# EAGLE design Relay Shield v3.0 (EAGLE 6.4)

## Sheet 1 of 2
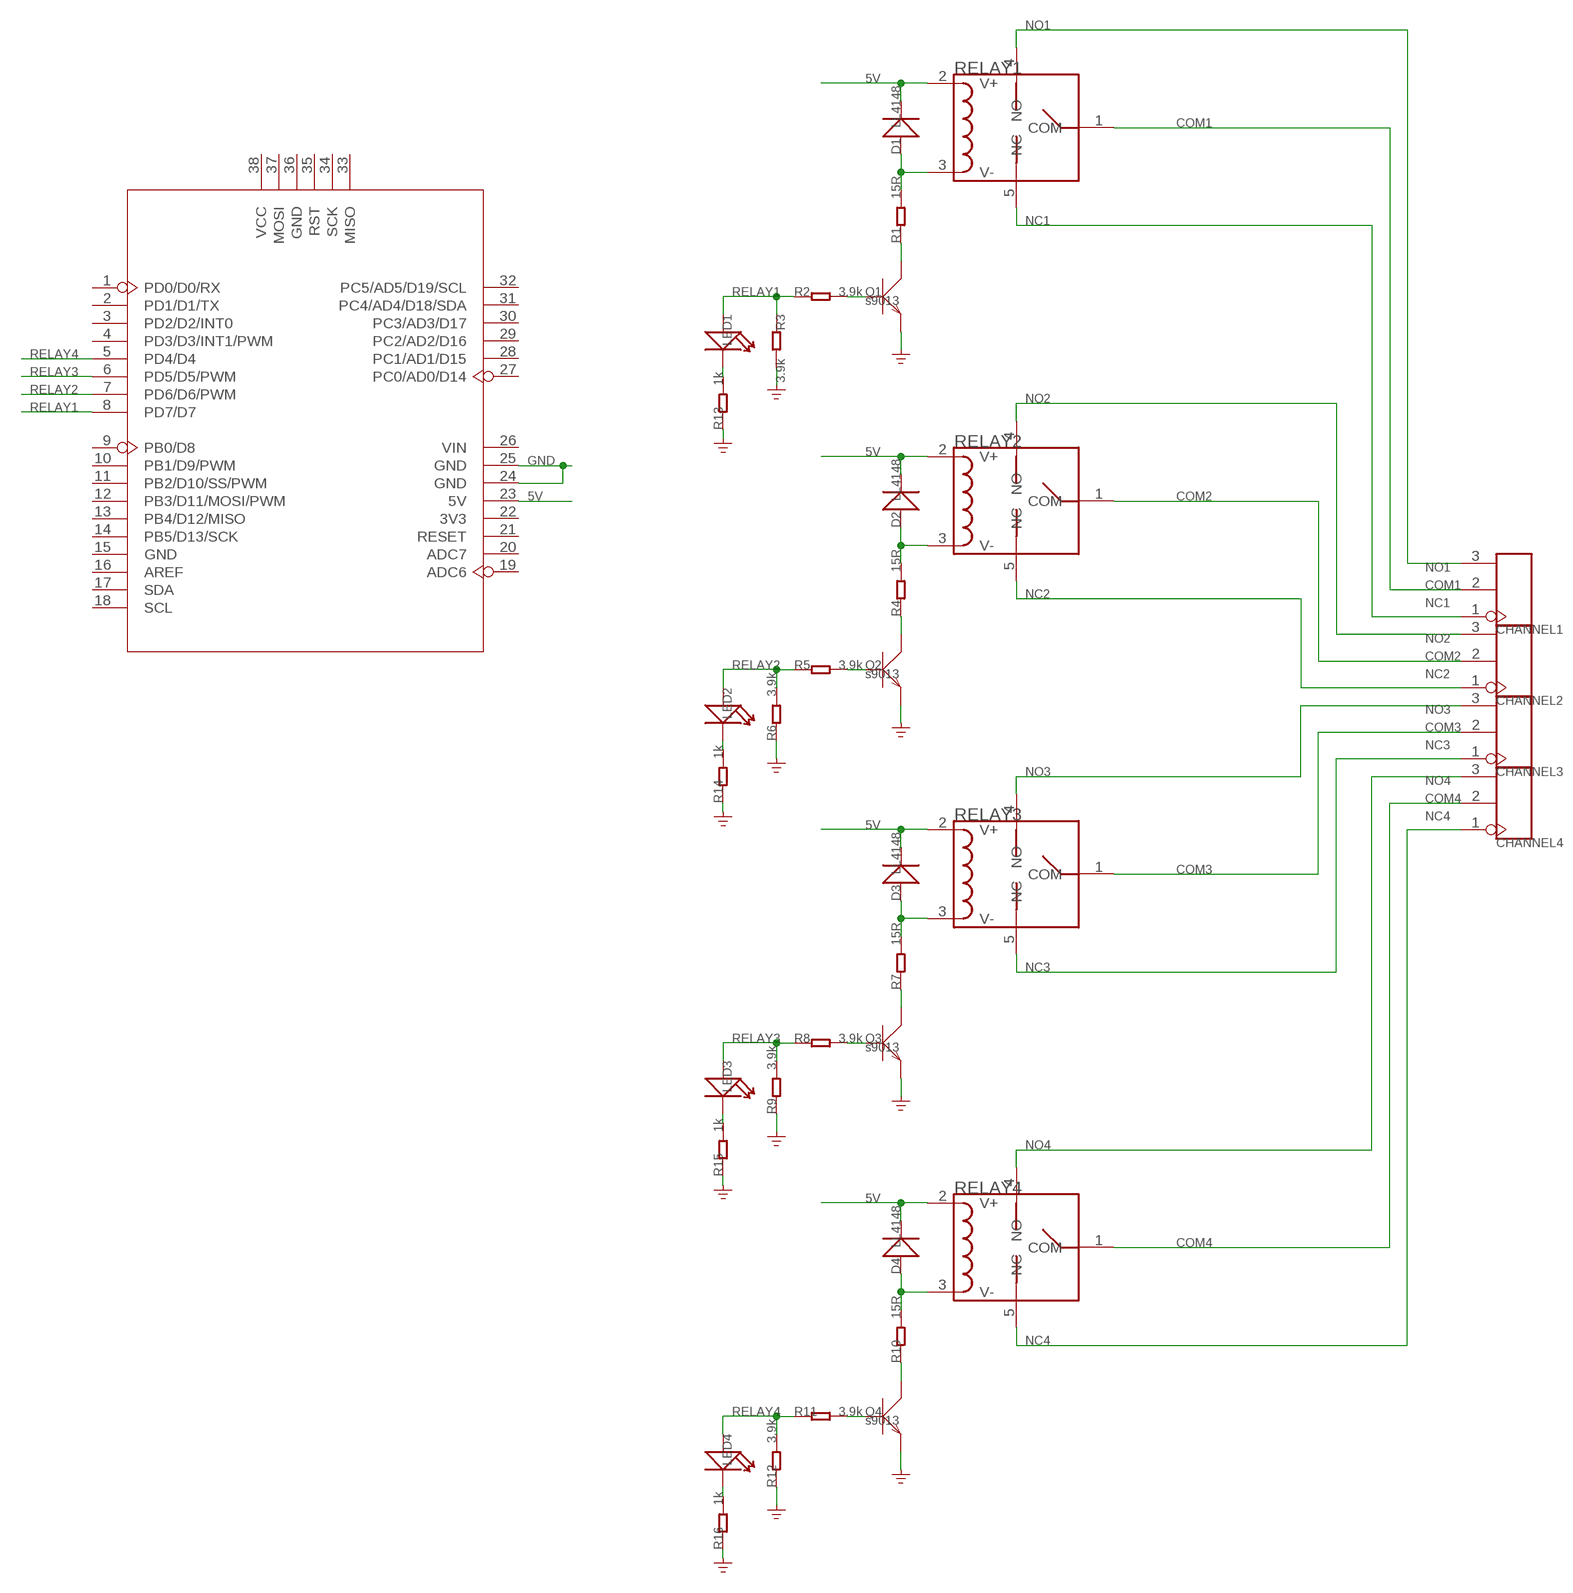
[diagram p0: schematic, sheet 1]

### Parts
CHANNEL1  SCREW-TERMINAL-3P'3.5'  [3P-3.5]
CHANNEL2  SCREW-TERMINAL-3P'3.5'  [3P-3.5]
CHANNEL3  SCREW-TERMINAL-3P'3.5'  [3P-3.5]
CHANNEL4  SCREW-TERMINAL-3P'3.5'  [3P-3.5]
D1  LL4148  D'1N4148-SMD'  [LL-34]
D2  LL4148  D'1N4148-SMD'  [LL-34]
D3  LL4148  D'1N4148-SMD'  [LL-34]
D4  LL4148  D'1N4148-SMD'  [LL-34]
LED1  LED'0603'  [LED-0603]
LED2  LED'0603'  [LED-0603]
LED3  LED'0603'  [LED-0603]
LED4  LED'0603'  [LED-0603]
Q1  s9013  TRANSISTOR-NPN-SOT23  [SOT23]
Q2  s9013  TRANSISTOR-NPN-SOT23  [SOT23]
Q3  s9013  TRANSISTOR-NPN-SOT23  [SOT23]
Q4  s9013  TRANSISTOR-NPN-SOT23  [SOT23]
R1  15R  R-0603  [R0603]
R2  3.9k  R-0603  [R0603]
R3  3.9k  R-0603  [R0603]
R4  15R  R-0603  [R0603]
R5  3.9k  R-0603  [R0603]
R6  3.9k  R-0603  [R0603]
R7  15R  R-0603  [R0603]
R8  3.9k  R-0603  [R0603]
R9  3.9k  R-0603  [R0603]
R10  15R  R-0603  [R0603]
R11  3.9k  R-0603  [R0603]
R12  3.9k  R-0603  [R0603]
R13  1k  R-0603  [R0603]
R14  1k  R-0603  [R0603]
R15  1k  R-0603  [R0603]
R16  1k  R-0603  [R0603]
RELAY1  RELAY-HLS8L-DC5V-S-C  [5P-19.0X15.5X15.8H]
RELAY2  RELAY-HLS8L-DC5V-S-C  [5P-19.0X15.5X15.8H]
RELAY3  RELAY-HLS8L-DC5V-S-C  [5P-19.0X15.5X15.8H]
RELAY4  RELAY-HLS8L-DC5V-S-C  [5P-19.0X15.5X15.8H]
U2  ARDUINO-38P  [ARDUINO-38P-WITH/-SILK-500519002]

### Nets
5V: D1.C(-) D2.C(-) D3.C(-) D4.C(-) RELAY1.2(V+) RELAY2.2(V+) RELAY3.2(V+) RELAY4.2(V+) U2.23(5V)
COM1: CHANNEL1.2 RELAY1.1(COM)
COM2: CHANNEL2.2 RELAY2.1(COM)
COM3: CHANNEL3.2 RELAY3.1(COM)
COM4: CHANNEL4.2 RELAY4.1(COM)
GND: Q1.2(E) Q2.2(E) Q3.2(E) Q4.2(E) R3.2 R6.1 R9.1 R12.1 R13.1 R14.1 R15.1 R16.1 U2.24(GND) U2.25(GND)
N$1: D2.A(+) R4.2 RELAY2.3(V-)
N$2: D3.A(+) R7.2 RELAY3.3(V-)
N$3: D4.A(+) R10.2 RELAY4.3(V-)
N$4: Q1.3(C) R1.1
N$5: Q2.3(C) R4.1
N$6: Q4.1(B) R11.2
N$7: D1.A(+) R1.2 RELAY1.3(V-)
N$8: Q3.3(C) R7.1
N$9: Q4.3(C) R10.1
N$11: Q3.1(B) R8.2
N$12: LED1.- R13.2
N$13: LED2.- R14.2
N$14: LED3.- R15.2
N$16: LED4.- R16.2
N$17: Q2.1(B) R5.2
N$23: Q1.1(B) R2.2
NC1: CHANNEL1.1 RELAY1.5(NC)
NC2: CHANNEL2.1 RELAY2.5(NC)
NC3: CHANNEL3.1 RELAY3.5(NC)
NC4: CHANNEL4.1 RELAY4.5(NC)
NO1: CHANNEL1.3 RELAY1.4(NO)
NO2: CHANNEL2.3 RELAY2.4(NO)
NO3: CHANNEL3.3 RELAY3.4(NO)
NO4: CHANNEL4.3 RELAY4.4(NO)
RELAY1: LED1.+ R2.1 R3.1 U2.8(PD7/D7)
RELAY2: LED2.+ R5.1 R6.2 U2.7(PD6/D6/PWM)
RELAY3: LED3.+ R8.1 R9.2 U2.6(PD5/D5/PWM)
RELAY4: LED4.+ R11.1 R12.2 U2.5(PD4/D4)
Unconnected: U2.1(PD0/D0/RX) U2.2(PD1/D1/TX) U2.3(PD2/D2/INT0) U2.4(PD3/D3/INT1/PWM) U2.9(PB0/D8) U2.10(PB1/D9/PWM) U2.11(PB2/D10/SS/PWM) U2.12(PB3/D11/MOSI/PWM) U2.13(PB4/D12/MISO) U2.14(PB5/D13/SCK) U2.15(GND) U2.16(AREF) U2.17(SDA) U2.18(SCL) U2.19(ADC6) U2.20(ADC7) U2.21(RESET) U2.22(3V3) U2.26(VIN) U2.27(PC0/AD0/D14) U2.28(PC1/AD1/D15) U2.29(PC2/AD2/D16) U2.30(PC3/AD3/D17) U2.31(PC4/AD4/D18/SDA) U2.32(PC5/AD5/D19/SCL) U2.33(MISO) U2.34(SCK) U2.35(RST) U2.36(GND) U2.37(MOSI) U2.38(VCC)

## Sheet 2 of 2
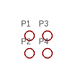
[diagram p1: schematic, sheet 2]

### Parts
P1  PAD-MARK  [ROUND-MARK-1.0]
P2  PAD-MARK  [ROUND-MARK-1.0]
P3  PAD-MARK  [ROUND-MARK-1.0]
P4  PAD-MARK  [ROUND-MARK-1.0]

## Library data of the parts
CHANNEL1-CHANNEL4 = Connector :SCREW-TERMINAL-3P
D1-D4 = Discrete:D*
LED1-LED4 = Discrete:LED*
P1-P4 = Discrete:PAD-MARK; PARTNO: DNP
Q1-Q4 = Discrete:TRANSISTOR-NPN*: NPN audion
R1-R16 = Discrete:R*
RELAY1-RELAY4 = Discrete:RELAY-HLS8L-DC5V-S-C
U2 = moudle:ARDUINO-38P

## Net classes
0 default: width 0.152 mm, drill 0.305 mm, clearance 0.152 mm

## Board
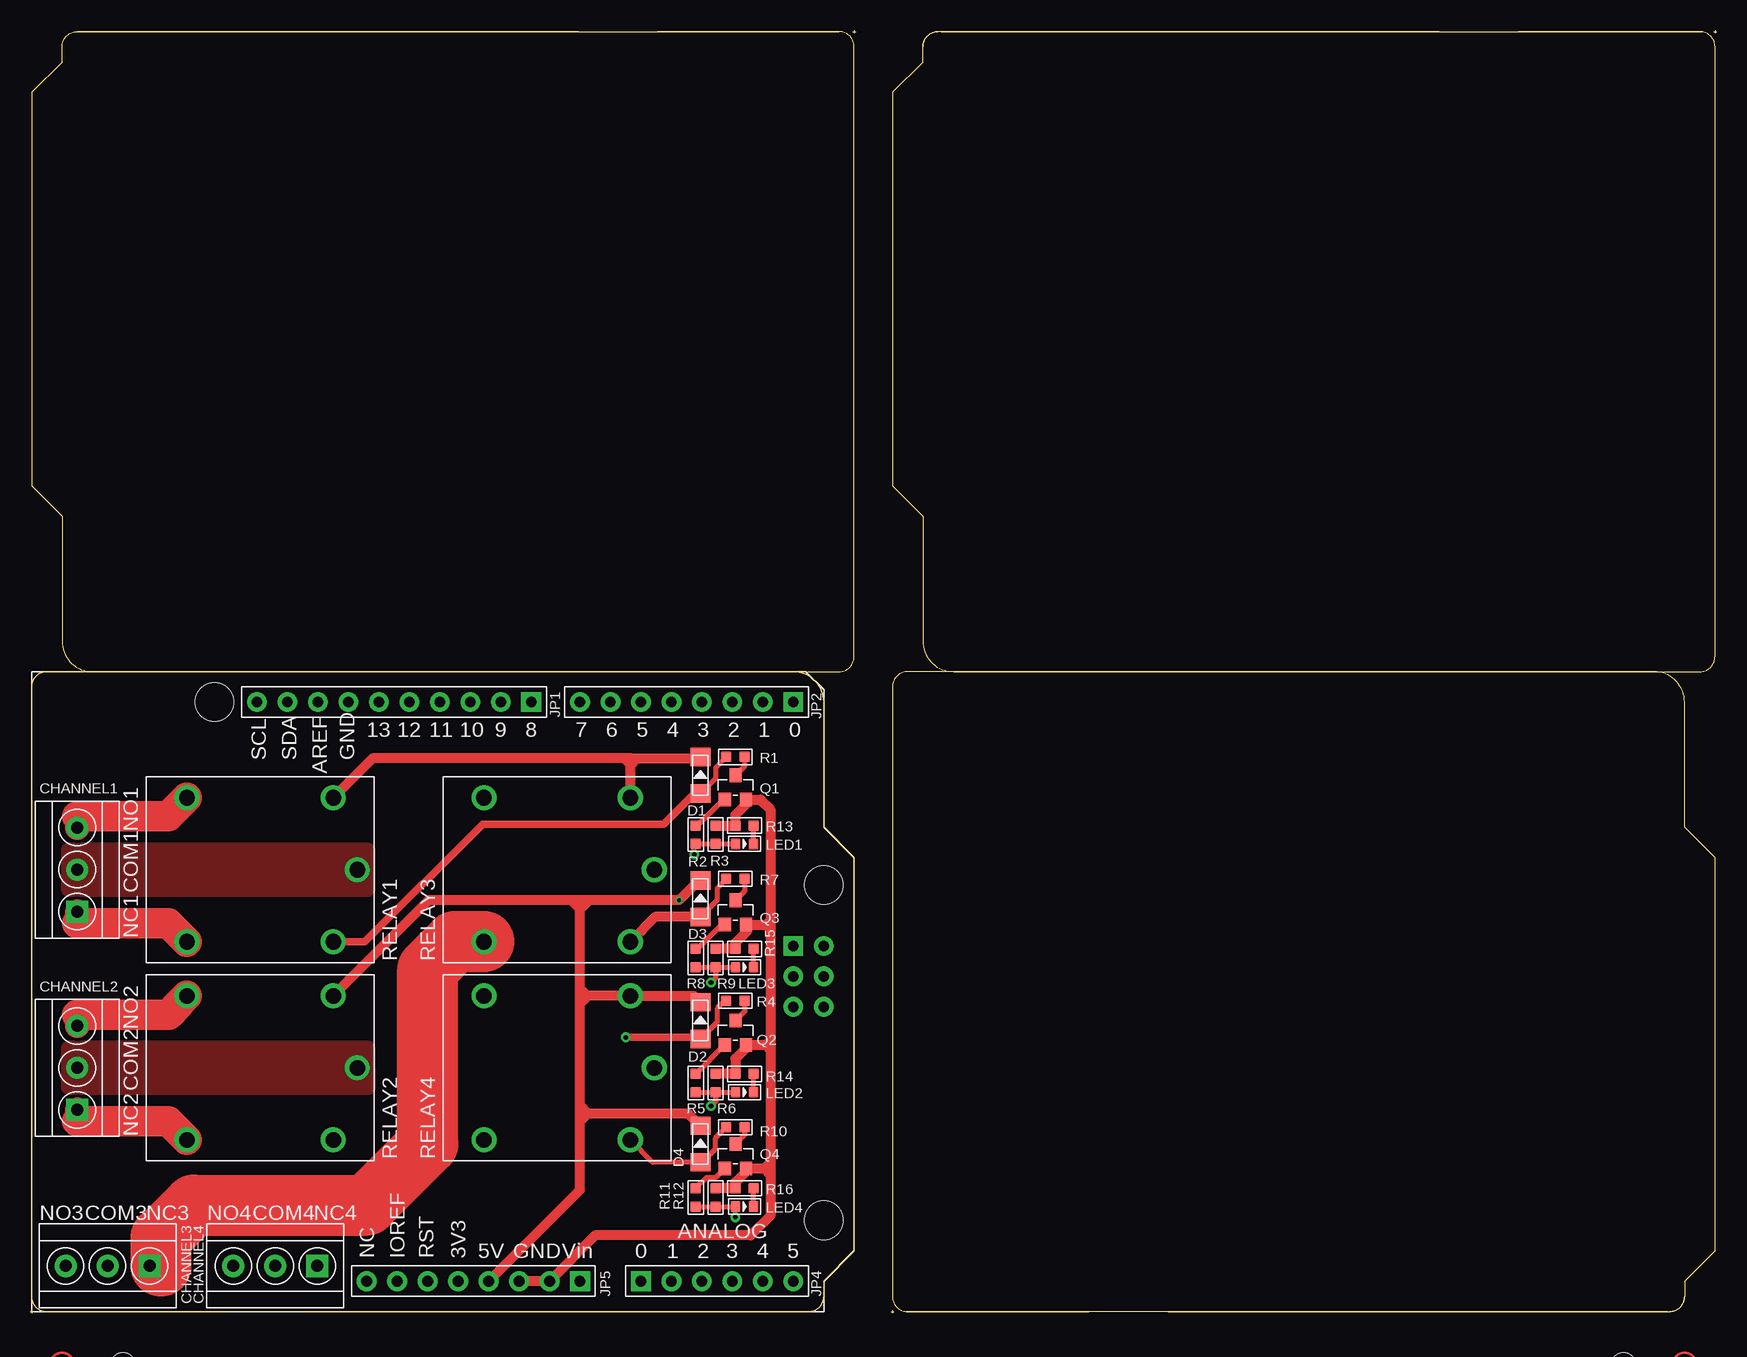
[diagram p2: board, top side]
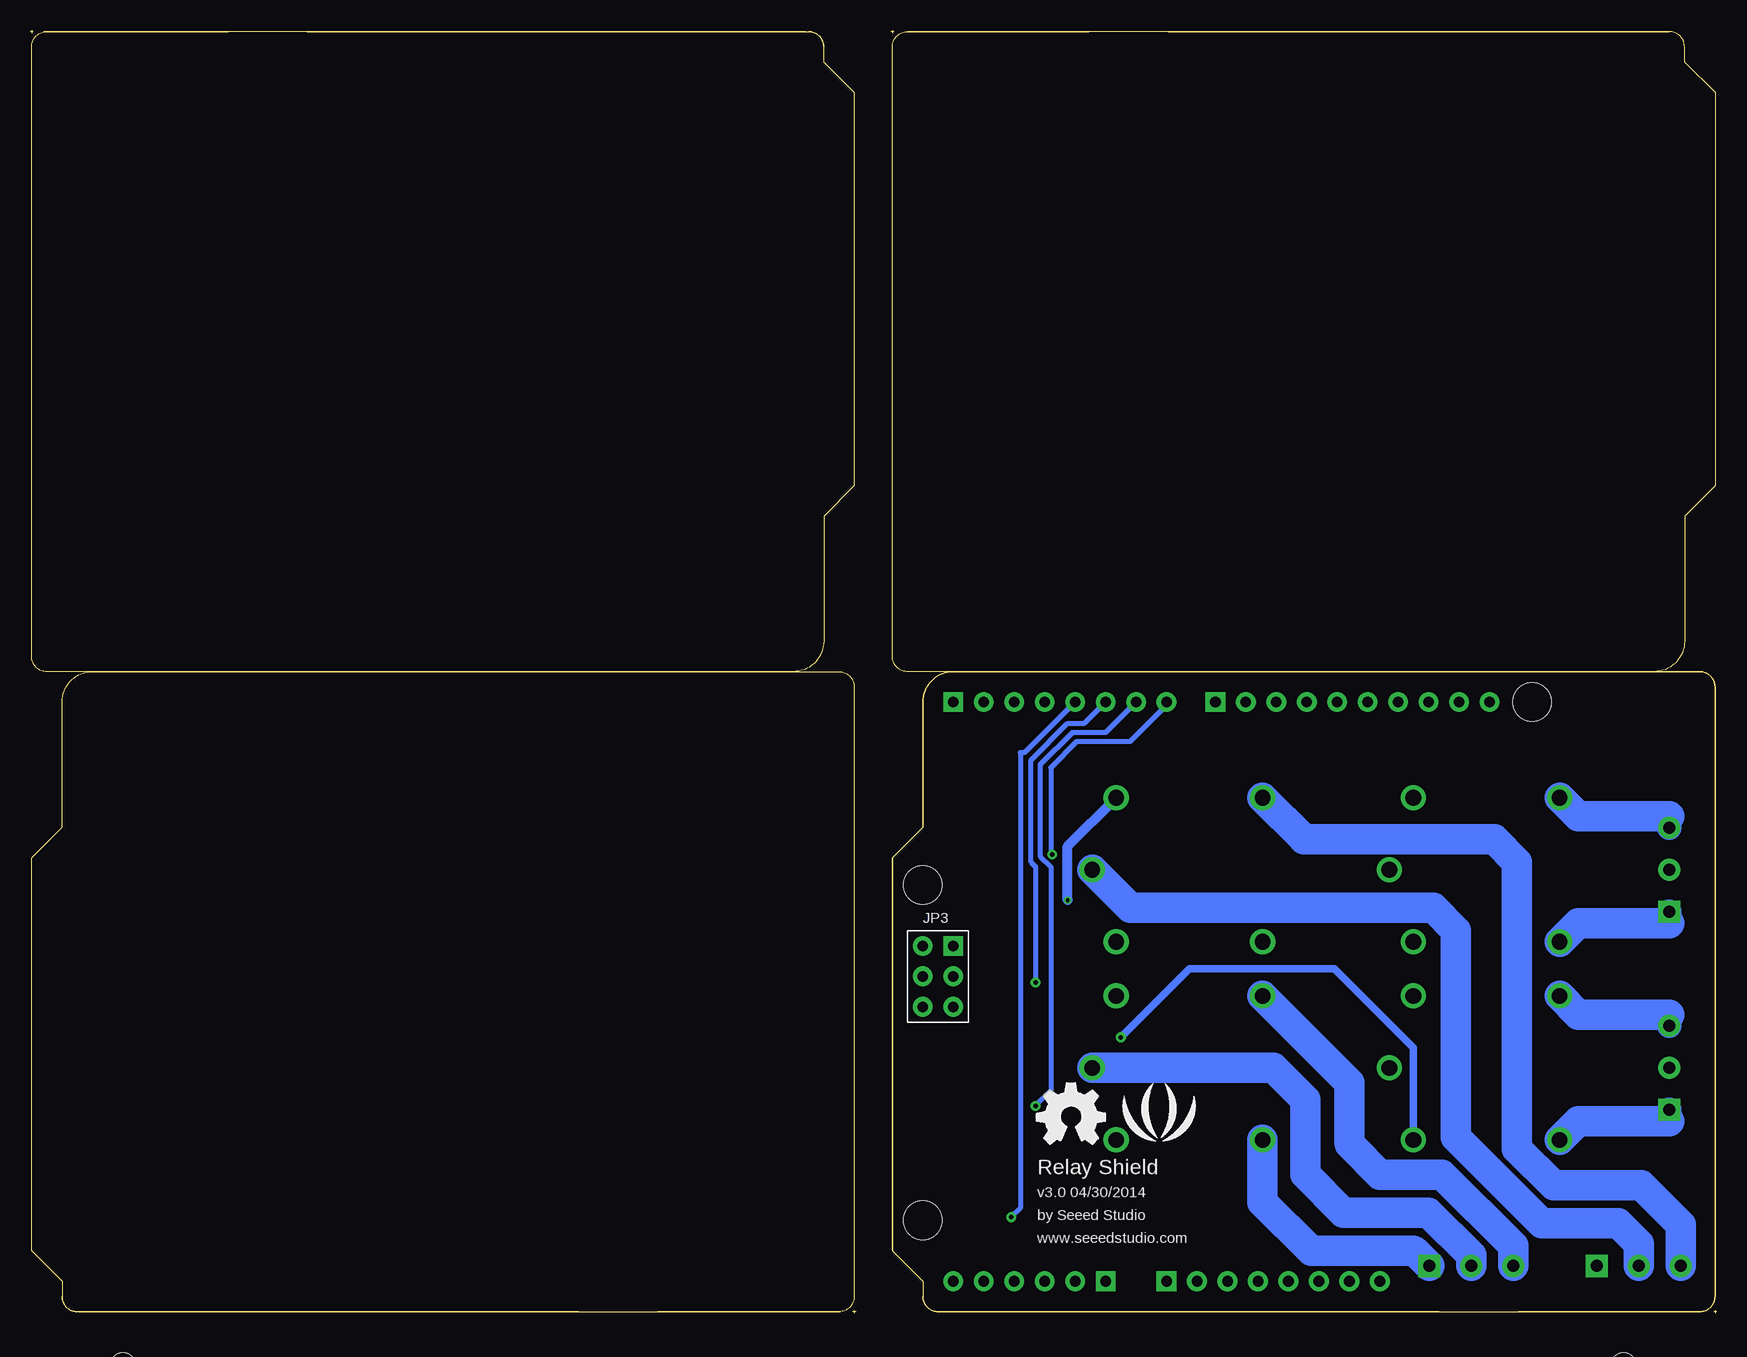
[diagram p3: board, bottom side, seen from below]

Size 140.59 x 106.93 mm. Coordinates in mm from the lower left corner, seen from the top.
Outline: 66.17,2.67 66.17,1.4
Outline: 66.17,1.4 arc-90 64.9,0.13
Outline: 64.9,0.13 1.4,0.13
Outline: 1.4,0.13 arc-90 0.13,1.4
Outline: 0.13,1.4 0.13,52.2
Outline: 0.13,52.2 arc-90 1.4,53.47
Outline: 1.4,53.47 63.63,53.47
Outline: 63.63,53.47 arc-90 66.17,50.93
Outline: 66.17,50.93 66.17,40.51
Outline: 66.17,40.51 68.71,37.97
Outline: 68.71,37.97 68.71,5.21
Outline: 68.71,5.21 66.17,2.67
Outline: 3.94,106.81 arc90 2.67,105.54 2.67,104.27 0.13,101.73 0.13,68.96 2.67,66.42 2.67,56.01 arc90 5.21,53.47 67.44,53.47 arc90 68.71,54.74 68.71,105.54 arc90 67.44,106.81
Outline: 139.19,53.47 arc90 140.46,54.74
Outline: 140.46,105.54 arc90 139.19,106.81
Outline: 75.69,106.81 arc90 74.42,105.54
Outline: 74.42,56.01 arc90 76.96,53.47
Outline: 73.15,53.47 arc90 71.88,52.2
Outline: 137.92,50.93 arc90 135.38,53.47
Outline: 45.74,106.81 3.94,106.81
Outline: 67.44,106.81 52.31,106.81
Outline: 0.13,1.4 arc90 1.4,0.13
Outline: 64.9,0.13 arc90 66.17,1.4
Outline: 73.15,53.47 arc90 71.88,52.2
Outline: 71.88,1.4 arc90 73.15,0.13
Outline: 136.65,0.13 arc90 137.92,1.4
Outline: 137.92,50.93 arc90 135.38,53.47
Outline: 1.4,53.47 arc90 0.13,52.2
Outline: 0.13,1.4 arc90 1.4,0.13
Outline: 64.9,0.13 arc90 66.17,1.4
Outline: 66.17,50.93 arc90 63.63,53.47
Outline: 74.42,105.54 74.42,104.27 71.88,101.73 71.88,68.96 74.42,66.42 74.42,56.01
Outline: 74.42,105.54 arc-90 75.69,106.81
Outline: 76.96,53.47 139.19,53.47
Outline: 139.19,53.47 arc90 140.46,54.74
Outline: 140.46,54.74 140.46,105.54
Outline: 140.46,105.54 arc90 139.19,106.81
Outline: 74.42,56.01 arc90 76.96,53.47
Outline: 117.49,106.81 75.95,106.81
Outline: 75.95,106.81 75.69,106.81
Outline: 139.19,106.81 124.06,106.81
Outline: 66.17,2.67 66.17,1.4
Outline: 66.17,1.4 arc-90 64.9,0.13
Outline: 63.63,53.47 1.4,53.47
Outline: 1.4,53.47 arc90 0.13,52.2
Outline: 0.13,52.2 0.13,1.4
Outline: 0.13,1.4 arc90 1.4,0.13
Outline: 66.17,2.67 68.71,5.21
Outline: 68.71,5.21 68.71,37.97
Outline: 68.71,37.97 66.17,40.51
Outline: 66.17,40.51 66.17,50.93
Outline: 66.17,50.93 arc90 63.63,53.47
Outline: 23.1,0.13 64.9,0.13
Outline: 1.4,0.13 16.53,0.13
Outline: 137.92,1.4 137.92,2.67 140.46,5.21 140.46,37.97 137.92,40.51 137.92,50.93
Outline: 137.92,1.4 arc-90 136.65,0.13
Outline: 135.38,53.47 73.15,53.47
Outline: 73.15,53.47 arc90 71.88,52.2
Outline: 71.88,52.2 71.88,1.4
Outline: 71.88,1.4 arc90 73.15,0.13
Outline: 137.92,50.93 arc90 135.38,53.47
Outline: 94.85,0.13 136.53,0.13
Outline: 136.53,0.13 136.65,0.13
Outline: 73.15,0.13 88.28,0.13
Outline: 0,0.13 0.25,0.13
Outline: 0.13,0.25 0.13,0
Outline: 71.75,0.13 72.01,0.13
Outline: 71.88,0.25 71.88,0
Outline: 68.58,106.81 68.83,106.81
Outline: 68.71,106.93 68.71,106.68
Outline: 140.34,106.81 140.59,106.81
Outline: 140.46,106.93 140.46,106.68
Outline: 136.53,0.13 73.02,0.13
Outline: 75.95,106.81 139.45,106.81
Outline: 3.94,106.81 67.44,106.81
Copper layers (1*16): Top 0.035mm / dielectric 1.5mm / Bottom 0.035mm
Design rules "default": minimum track width 6mil, minimum drill 12mil, track to track 6mil, track to pad 6mil, pad to pad 6mil, via to via 6mil, smd to smd 0mil, copper to edge 10mil, drill to drill 10mil, minimum pad ring 10mil, minimum via ring 6mil, stop-mask expansion 2mil, vias tented up to drill 100mil, thermal gap 10mil
Holes 2.03 mm at 7.75,111.25 132.84,111.25 132.84,-4.32 7.75,-4.32

### Footprints (pad centres in the part's own frame; a part is rotated, then mirrored left to right if it is on the bottom)
3P-3.5 = drill 1 pad 1.85 square: 1 0,-3.5 | drill 1 pad 1.85: 2 0,0; 3 0,3.5
LL-34 = smd 1.524 x 1.676: A -1.524,0; C 1.524,0
LED-0603 = smd 0.762 x 0.889: + -0.762,0; - 0.762,0
ROUND-MARK-1.0 = smd 1.016 x 1.016: P$1 0,0
SOT23 = smd 1.016 x 1.143: 1 -0.889,-1.016; 2 0.889,-1.016; 3 0,1.016
R0603 = smd 0.889 x 0.889: 1 -0.762,0; 2 0.762,0
5P-19.0X15.5X15.8H = drill 1.3 pad 2.1: 1 -8.1,0; 2 -6.1,-6; 3 -6.1,6; 4 6.1,-6; 5 6.1,6
ARDUINO-38P-WITH/-SILK-500519002 = drill 0.889 pad 1.651 square: 1 63.5,50.8; 9 41.656,50.8; 26 45.72,2.54; 27 50.8,2.54; 33 63.5,30.48 | drill 0.889 pad 1.651: 2 60.96,50.8; 3 58.42,50.8; 4 55.88,50.8; 5 53.34,50.8; 6 50.8,50.8; 7 48.26,50.8; 8 45.72,50.8; 10 39.116,50.8; 11 36.576,50.8; 12 34.036,50.8; 13 31.496,50.8; 14 28.956,50.8; 15 26.416,50.8; 16 23.876,50.8; 17 21.336,50.8; 18 18.796,50.8; 19 27.94,2.54; 20 30.48,2.54; 21 33.02,2.54; 22 35.56,2.54; 23 38.1,2.54; 24 40.64,2.54; 25 43.18,2.54; 28 53.34,2.54; 29 55.88,2.54; 30 58.42,2.54; 31 60.96,2.54; 32 63.5,2.54; 34 63.5,27.94; 35 63.5,25.4; 36 66.04,25.4; 37 66.04,27.94; 38 66.04,30.48 | hole 3.2: 15.24,50.8; 66.04,35.56; 66.04,7.62

### Placement (x,y rotation side)
CHANNEL1  3.94,36.96 0 top
CHANNEL2  3.94,20.45 0 top
CHANNEL3  6.48,3.94 90 top
CHANNEL4  20.45,3.94 90 top
D1  55.88,44.83 90 top
D2  55.88,24.38 90 top
D3  55.88,34.54 90 top
D4  55.88,14.1 90 top
LED1  59.56,39.12 0 top
LED2  59.56,18.41 0 top
LED3  59.56,28.83 0 top
LED4  59.56,8.89 0 top
P1  2.67,-4.32 0 top  (outside the outline)
P2  137.92,-4.32 0 top  (outside the outline)
P3  2.67,111.25 0 top  (outside the outline)
P4  137.92,111.25 0 top  (outside the outline)
Q1  58.8,43.82 0 top
Q2  58.8,23.37 0 top
Q3  58.8,33.4 0 top
Q4  58.8,13.08 0 top
R1  58.8,46.36 180 top
R2  55.5,39.88 90 top
R3  57.15,39.88 90 top
R4  58.8,26.04 180 top
R5  55.5,19.18 90 top
R6  57.15,19.18 270 top
R7  58.8,36.2 180 top
R8  55.5,29.59 90 top
R9  57.15,29.59 270 top
R10  58.8,15.49 180 top
R11  55.5,9.65 90 top
R12  57.15,9.65 270 top
R13  59.56,40.64 0 top
R14  59.56,19.94 0 top
R15  59.56,30.35 0 top
R16  59.56,10.41 0 top
RELAY1  19.18,36.96 180 top
RELAY2  19.18,20.45 180 top
RELAY3  43.94,36.96 180 top
RELAY4  43.94,20.45 180 top
U2  0.13,0.13 0 top
U$13  [LOGO_SILK]  46.48,16 0 bottom
U$14  [OSHW_FILLX200_NOTEXT]  56.64,14.1 0 bottom

### Tracks (layer width: path | path; a pad name or v marks a point on that pad's centre or on a via)
5V  (via drill 0.3)
  Top 0.406: 55.63,35.94 55.75,35.94 D3.C
  Top 0.813: 50.16,46.23 49.53,46.23 | 49.53,46.23 28.55,46.23 RELAY1.2 | RELAY3.2 50.04,45.72 | 50.04,45.72 50.04,46.11 50.16,46.23 | U2.23 45.85,10.29 45.85,16 | 45.85,16.51 45.85,17.27 | 45.85,17.27 45.85,25.78 | 45.85,25.78 45.85,26.54 | 45.85,26.54 45.85,27.05 | 45.85,27.05 45.85,33.66 | 45.85,33.66 45.85,34.42 | 55.63,35.94 v54.1,34.42 45.85,34.42 | 45.85,34.42 45.09,34.42 | 45.09,34.42 33.25,34.42 RELAY2.2 | 45.09,34.42 45.85,33.66 | 45.85,33.66 46.48,34.29 | 46.51,26.45 RELAY4.2 55.34,26.45 D2.C | 46.51,26.45 46.45,26.45 | 46.45,26.45 45.94,26.45 45.85,26.54 | 46.45,26.45 45.85,27.05 | 46.51,26.45 45.85,25.78 | 46.48,16.64 54.86,16.64 D4.C | 46.48,16.64 45.97,16.64 45.85,16.51 | 46.48,16.64 45.85,17.27 | 46.48,16.64 45.85,16 | 45.85,16 45.85,16.51 | 50.16,46.23 50.55,46.23 | 50.55,46.23 55.75,46.23 D1.C | 50.04,45.72 49.53,46.23 | 50.04,45.72 | 50.04,45.72 50.55,46.23
  Bottom 0.813: v54.1,34.42 54.1,38.9 RELAY3.2
COM1
  pour Top (isolate 0.254, no thermals): 2.67,38.48 2.67,35.43 arc90 3.3,34.8 28.07,34.8 arc90 28.7,35.43 28.7,38.48 arc90 28.07,39.12 3.3,39.12 arc90
COM2
  pour Top (isolate 0.254, no thermals): 2.67,18.92 2.67,21.97 arc-90 3.3,22.61 28.06,22.62 arc-90 28.69,22 28.72,18.92 arc-91 28.09,18.27 3.3,18.29 arc-90
COM3
  Bottom 2.54: CHANNEL3.2 6.48,5.78 8.19,7.49 14.56,7.49 21.72,14.65 21.72,31.88 23.62,33.78 48.87,33.78 RELAY3.1
COM4
  Bottom 2.54: RELAY4.1 36.96,20.45 34.29,17.78 34.29,11.58 31.09,8.38 24.01,8.38 20.45,4.82 CHANNEL4.2
GND
  Top 0.203: 59.75,11.87 59.69,11.87 Q4.2 | Q2.2 59.75,22.35 59.75,22.16
  Top 0.406: 59.75,31.81 59.75,32.32 Q3.2
  Top 0.813: R3.2 R13.1 58.8,41.53 59.69,42.42 Q1.2 60.91,42.8 61.72,41.98 61.72,32.77 | 59.75,31.81 58.8,30.86 R15.1 R9.1 | 59.75,22.16 58.8,21.21 R14.1 R6.1 | 61.72,32.77 61.72,32.13 | 61.72,32.13 61.72,32 | 61.72,32 61.72,22.73 | 61.72,22.73 61.72,22.48 | Q2.2 61.34,22.35 | 61.34,22.35 61.6,22.35 61.72,22.48 | Q3.2 61.34,32.39 | 61.34,32.39 61.47,32.39 61.72,32.13 | 61.72,22.48 61.72,21.97 | 61.72,21.97 61.72,12.57 | 61.72,12.57 61.72,12.07 | 61.72,12.07 61.72,11.56 | 61.72,11.56 61.72,8.13 60.07,6.48 47.12,6.48 U2.25 U2.24 | 59.75,11.87 58.8,10.92 R16.1 R12.1 | Q4.2 61.21,12.07 | 61.21,12.07 61.72,12.07 | 61.21,12.07 61.72,12.57 | 61.21,12.07 61.72,11.56 | 61.34,22.35 61.72,22.73 | 61.34,22.35 61.72,21.97 | 61.34,32.39 61.72,32.77 | 61.34,32.39 61.72,32
N$1  (via drill 0.38 pad 0.81)
  Top 0.406: R4.2 57.91,26.04 57.28,25.4 57.28,24.26 D2.A
  Top 0.61: v49.66,22.99 55.75,22.99 D2.A
  Bottom 0.61: RELAY2.3 25.28,22.1 31.88,28.7 43.94,28.7 v49.66,22.99
N$2
  Top 0.406: R7.2 57.28,35.43 57.28,34.42 D3.A
  Top 0.813: D3.A 52.11,33.02 RELAY3.3
N$3
  Top 0.406: R10.2 57.15,14.61 57.15,13.72 56.39,12.95 56.39,12.45 56.26,12.57 D4.A 51.92,12.57 RELAY4.3
N$4
  Top 0.406: R1.1 59.56,45.59 Q1.3
N$5
  Top 0.406: R4.1 59.56,25.15 Q2.3
N$6
  Top 0.406: Q4.1 57.85,12 57.15,11.3 56.39,11.3 R11.2
N$7
  Top 0.406: R1.2 57.15,45.47 57.15,44.58 D1.A
  Top 0.61: RELAY1.3 27.91,30.96 37.72,40.77 52.83,40.77 55.37,43.31 D1.A
N$8
  Top 0.406: R7.1 59.56,35.18 Q3.3
N$9
  Top 0.406: R10.1 59.56,14.86 Q4.3
N$11
  Top 0.406: R8.2 55.63,30.35 57.66,32.39 Q3.1
N$12
  Top 0.406: LED1.- R13.2
N$13
  Top 0.406: LED2.- R14.2
N$14
  Top 0.406: LED3.- R15.2
N$16
  Top 0.406: LED4.- R16.2
N$17
  Top 0.406: R5.2 55.5,20 55.56,20 Q2.1
N$23
  Top 0.406: R2.2 55.69,40.64 55.69,40.71 57.79,42.8 Q1.1
NC1
  Top 2.032: CHANNEL1.1 3.94,32.51
  Top 2.54: 3.94,32.51 11.52,32.51 RELAY1.5
  Bottom 2.032: CHANNEL1.1 3.94,32.51
  Bottom 2.54: 3.94,32.51 11.52,32.51 RELAY1.5
NC2
  Top 2.032: CHANNEL2.1 3.94,16
  Top 2.54: 3.94,16 11.52,16 RELAY2.5
  Bottom 2.032: CHANNEL2.1 3.94,16
  Bottom 2.54: 3.94,16 11.52,16 RELAY2.5
NC3
  Top 2.54: CHANNEL3.1 10.92,3.94
  Top 5.08: 10.92,3.94 10.92,6.29 13.65,9.02 28.07,9.02 33.15,14.1 33.15,28.7 35.4,30.96 RELAY3.5
NC4
  Bottom 2.54: CHANNEL4.1 25.03,5.02 arc-45 25.48,5.21 33.78,5.21 37.84,9.27 RELAY4.5
NO1
  Top 2.032: CHANNEL1.3 3.94,41.4
  Top 2.54: 3.94,41.4 11.52,41.4 RELAY1.4
  Bottom 2.032: CHANNEL1.3 3.94,41.4
  Bottom 2.54: 3.94,41.4 11.52,41.4 RELAY1.4
NO2
  Top 2.032: CHANNEL2.3 3.94,24.89
  Top 2.54: 3.94,24.89 10.03,24.89 11.52,24.89 | 11.52,24.89 11.56,24.89 12.44,25.78 | 11.52,24.89 RELAY2.4
  Bottom 2.032: 3.94,24.89 CHANNEL2.3
  Bottom 2.54: 3.94,24.89 11.18,24.89 11.52,24.89 RELAY2.4
NO3
  Bottom 2.54: CHANNEL3.3 2.98,7.36 6.29,10.67 13.59,10.67 16.64,13.72 16.64,37.59 18.54,39.5 34.42,39.5 34.42,39.53 RELAY3.4
NO4
  Bottom 2.54: RELAY4.4 30.61,19.21 30.61,14.36 arc-45 30.42,13.91 28.07,11.56 22.9,11.56 16.95,5.61 CHANNEL4.3
RELAY1  (via drill 0.38 pad 0.81)
  Top 0.406: LED1.+ R3.1 R2.1 55.37,38.99 v55.37,38.23
  Bottom 0.406: U2.8 45.85,50.67 48.9,47.62 53.34,47.62 55.5,45.47 55.5,38.35 v55.37,38.23
RELAY2  (via drill 0.38 pad 0.81)
  Top 0.406: R5.1 R6.2 | R6.2 LED2.+ | R6.2 57.15,17.65 v56.77,17.27
  Bottom 0.406: U2.7 50.93,48.39 53.71,48.39 56.39,45.71 56.39,38.1 55.5,37.21 55.5,18.54 v56.77,17.27
RELAY3  (via drill 0.38 pad 0.81)
  Top 0.406: R8.1 R9.2 | R9.2 LED3.+ | R9.2 57.15,27.94 v56.77,27.56
  Bottom 0.406: U2.6 52.71,49.15 54.1,49.15 57.15,46.1 57.15,37.59 56.77,37.21 v56.77,27.56
RELAY4  (via drill 0.38 pad 0.81)
  Top 0.406: R11.1 R12.2 LED4.+ v58.8,8
  Bottom 0.406: v58.8,8 58.04,8.76 58.04,46.74 57.66,46.74 U2.5

### Text on the board
tPlace: NO1 | COM1 | NC1 | NO2 | COM2 | NC2 | NO3 | COM3 | NC3 | NO4 | COM4 | NC4
bPlace: Relay Shield | v3.0 04/30/2014 | by Seeed Studio | www.seeedstudio.com